# EAGLE design ac_monitor (EAGLE 9.5.2)
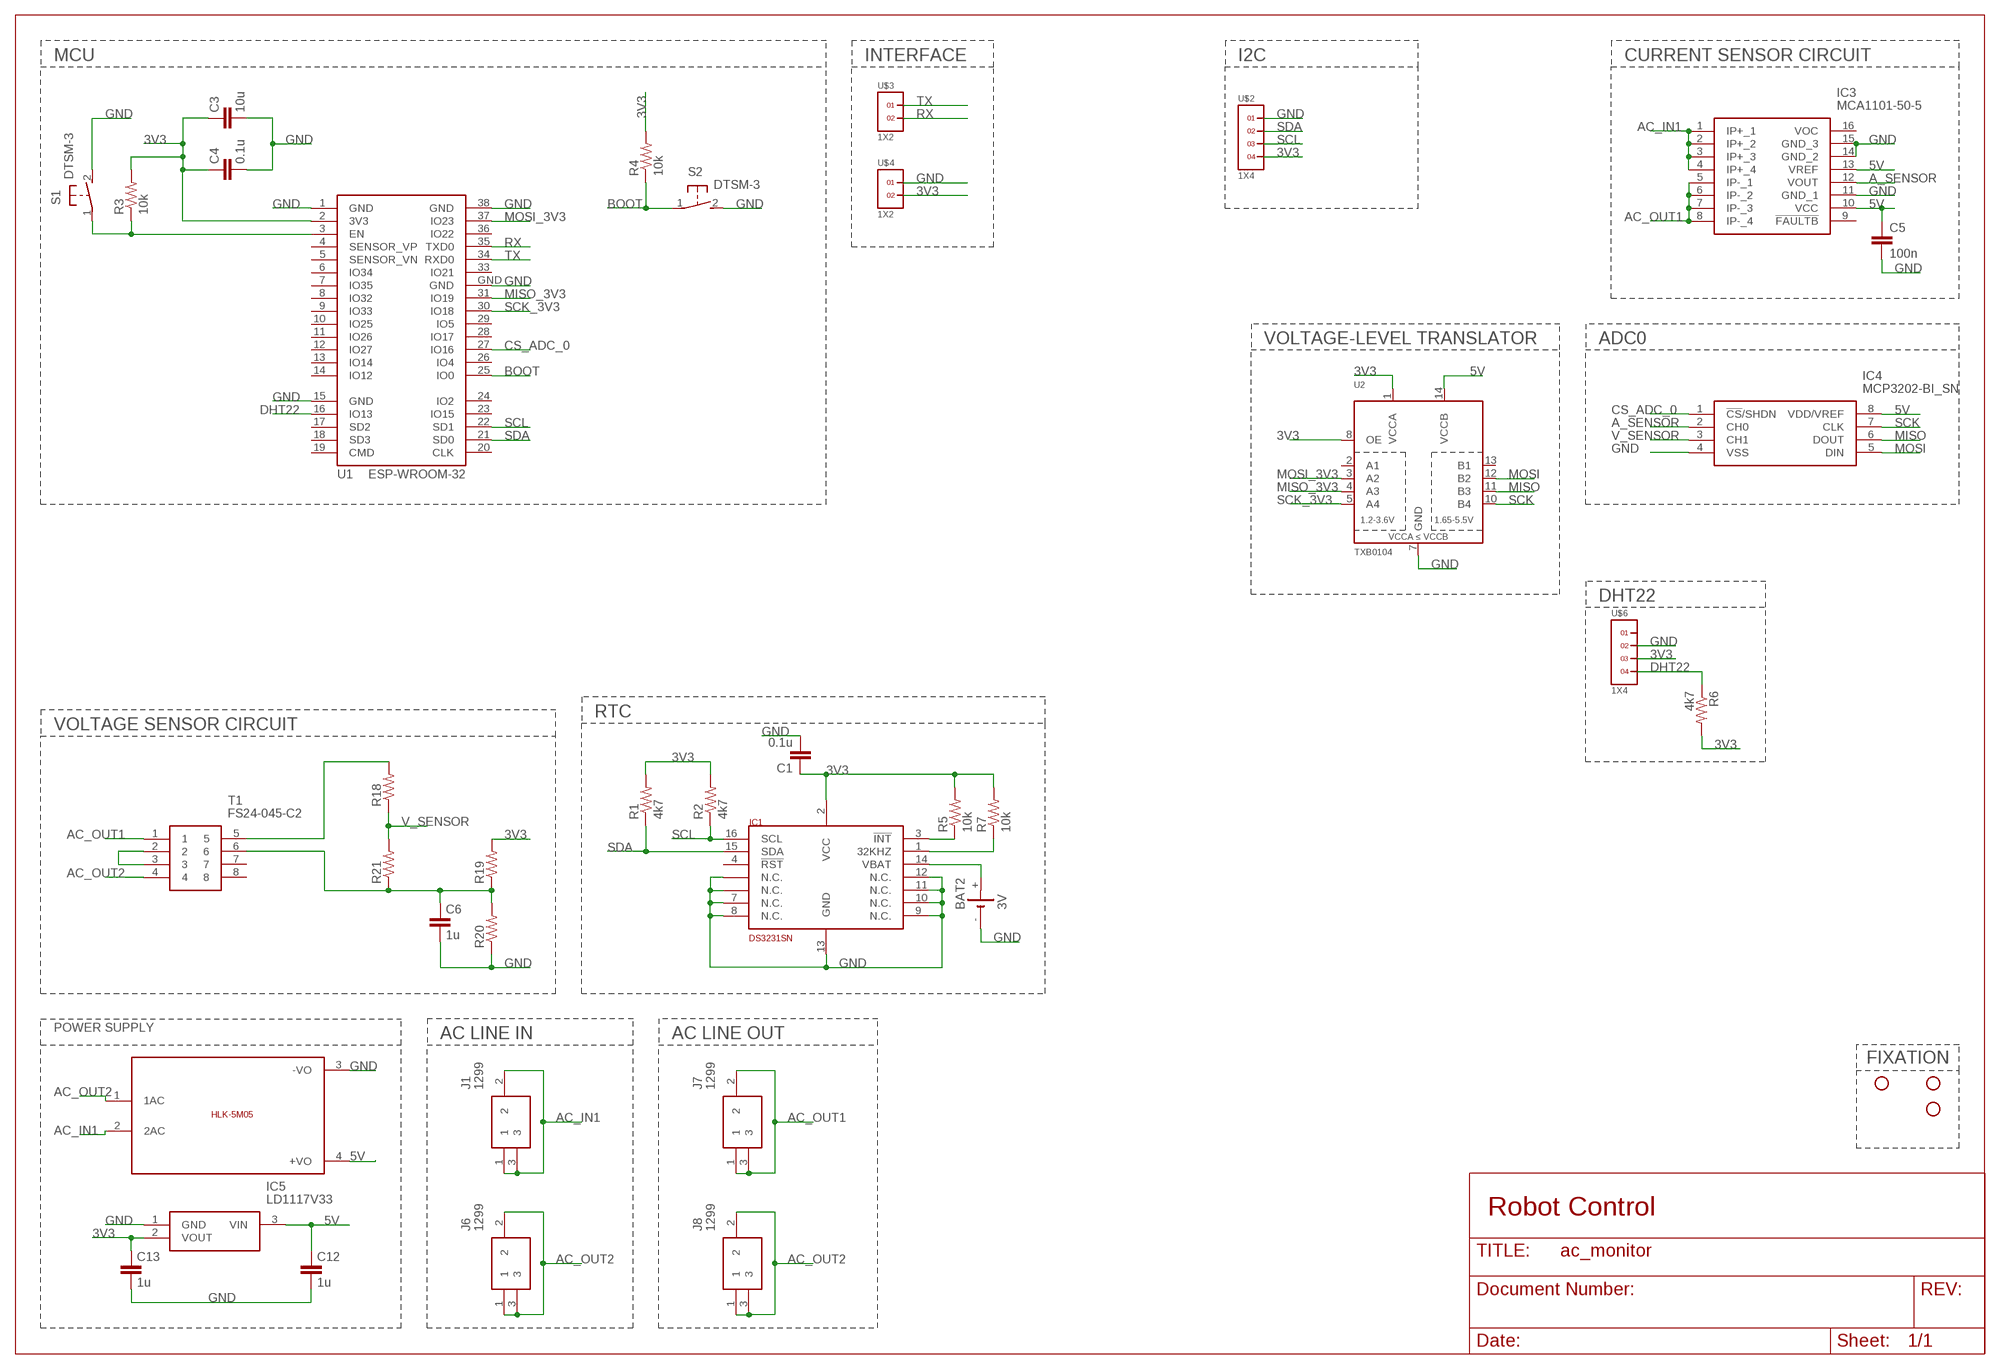
[diagram p0: schematic, sheet 1]

## Parts
BAT2  3V  CH291-1220LF  [CH291-1220LF]
C1  0.1u  C-EUC0805K  [C0805K]
C3  10u  C-EUC0805  [C0805]
C4  0.1u  C-EUC0805  [C0805]
C5  100n  C-EUC0805K  [C0805K]
C6  1u  C-EUC0805  [C0805]
C12  1u  C-EU025-025X050  [C025-025X050]
C13  1u  C-EU025-025X050  [C025-025X050]
IC1  DS3231SN  [SO16W]
IC3  MCA1101-50-5  [SOIC127P1031X264-16N]
IC4  MCP3202-BI_SN  [SOIC127P600X175-8N]
IC5  LD1117V33  [TO270P460X1020X2008-3P]
J1  1299  [1299]
J6  1299  [1299]
J7  1299  [1299]
J8  1299  [1299]
R1  4k7  R-US_R0805  [R0805]
R2  4k7  R-US_R0805  [R0805]
R3  10k  R-US_R0805  [R0805]
R4  10k  R-US_R0805  [R0805]
R5  10k  R-US_R0805  [R0805]
R6  4k7  R-US_R0805  [R0805]
R7  10k  R-US_R0805  [R0805]
R18  270k  R-US_R0805  [R0805]
R19  120k  R-US_R0805  [R0805]
R20  470k  R-US_R0805  [R0805]
R21  33k  R-US_R0805  [R0805]
S1  DTSM-3  [DTSM-3]
S2  DTSM-3  [DTSM-3]
STANDOFF2  STAND-OFF  [STAND-OFF]
STANDOFF3  STAND-OFF  [STAND-OFF]
STANDOFF4  STAND-OFF  [STAND-OFF]
T1  FS24-045-C2  [FS24045C2]
U1  ESP-WROOM-32  [ESP-WROOM-32]
U2  TXB0104  TXB0104PWR  [TSSOP14]
U$2  1X4  [1X4]
U$3  1X2  [1X2]
U$4  1X2  [1X2]
U$5  5VDC/5W  HLK-5M05  [HLK-5M05]
U$6  1X4  [1X4]

## Nets
3V3: C1.1 C3.1 C4.1 C13.1 IC1.2(VCC) IC5.2(VOUT) R1.2 R2.2 R3.2 R4.2 R5.2 R6.2 R7.2 R19.2 U1.2(3V3) U2.1(VCCA) U2.8(OE) U$2.4 U$4.2 U$6.3
5V: C5.1 C12.1 IC3.10(VCC) IC3.13(VREF) IC4.8(VDD/VREF) IC5.3(VIN) U2.14(VCCB) U$5.4(+VO)
A_SENSOR: IC3.12(VOUT) IC4.2(CH0)
AC_IN1: IC3.1(IP+_1) IC3.2(IP+_2) IC3.3(IP+_3) IC3.4(IP+_4) J1.1 J1.2 J1.3 U$5.2(2AC)
AC_OUT1: IC3.5(IP-_1) IC3.6(IP-_2) IC3.7(IP-_3) IC3.8(IP-_4) J7.1 J7.2 J7.3 T1.1
AC_OUT2: J6.1 J6.2 J6.3 J8.1 J8.2 J8.3 T1.4 U$5.1(1AC)
BOOT: R4.1 S2.1 U1.25(IO0)
CS_ADC_0: IC4.1(!CS!/SHDN) U1.27(IO16)
DHT22: R6.1 U1.16(IO13) U$6.4
GND: BAT2.- C1.2 C3.2 C4.2 C5.2 C6.2 C12.2 C13.2 IC1.5(N.C.) IC1.6(N.C.) IC1.7(N.C.) IC1.8(N.C.) IC1.9(N.C.) IC1.10(N.C.) IC1.11(N.C.) IC1.12(N.C.) IC1.13(GND) IC3.11(GND_1) IC3.14(GND_2) IC3.15(GND_3) IC4.4(VSS) IC5.1(GND) R20.1 S1.2 S2.2 U1.1(GND) U1.15(GND) U1.38(GND) U1.GND U2.7(GND) U$2.1 U$4.1 U$5.3(-VO) U$6.2
MISO: IC4.6(DOUT) U2.11(B3)
MISO_3V3: U1.31(IO19) U2.4(A3)
MOSI: IC4.5(DIN) U2.12(B2)
MOSI_3V3: U1.37(IO23) U2.3(A2)
N$1: R18.2 T1.5
N$2: IC1.3(!INT) R5.1
N$3: T1.2 T1.3
N$4: IC1.1(32KHZ) R7.1
N$5: R3.1 S1.1 U1.3(EN)
N$12: C6.1 R19.1 R20.2 R21.1 T1.6
N$17: BAT2.+ IC1.14(VBAT)
RX: U1.35(TXD0) U$3.2
SCK: IC4.7(CLK) U2.10(B4)
SCK_3V3: U1.30(IO18) U2.5(A4)
SCL: IC1.16(SCL) R2.1 U1.22(SD1) U$2.3
SDA: IC1.15(SDA) R1.1 U1.21(SD0) U$2.2
TX: U1.34(RXD0) U$3.1
V_SENSOR: IC4.3(CH1) R18.1 R21.2
Unconnected: IC1.4(!RST) IC3.9(!FAULTB) IC3.16(VOC) T1.7 T1.8 U1.4(SENSOR_VP) U1.5(SENSOR_VN) U1.6(IO34) U1.7(IO35) U1.8(IO32) U1.9(IO33) U1.10(IO25) U1.11(IO26) U1.12(IO27) U1.13(IO14) U1.14(IO12) U1.17(SD2) U1.18(SD3) U1.19(CMD) U1.20(CLK) U1.23(IO15) U1.24(IO2) U1.26(IO4) U1.28(IO17) U1.29(IO5) U1.33(IO21) U1.36(IO22) U2.2(A1) U2.13(B1) U$6.1

## Notes on the sheet
- MCU | INTERFACE | I2C | CURRENT SENSOR CIRCUIT
- VOLTAGE-LEVEL TRANSLATOR | ADC0
- DHT22
- RTC
- VOLTAGE SENSOR CIRCUIT
- POWER SUPPLY
- AC LINE IN | AC LINE OUT
- FIXATION
- Robot Control

## Library data of the parts
BAT2 = battery:CH291-1220LF: Battery Holder, SMT, 12mm multicomp PART NO. CH291-1220LF Source: Data sheet <http://www.farnell.com/datasheets/1505860.pdf>
C1 C3-C6 C12 C13 = rcl:C-EU: CAPACITOR, European symbol; SPICEPREFIX: C
IC1 = electronic-labs:DS3231SN
IC3 = MCA1101-50-5:MCA1101-50-5: Board Mount Current Sensors High Accuracy 50A Current Sensor, 5V, Fixed gain, 1.5MHz 3dB BW, OCP, Galvanic Isolation. UL/IEC/EN60950-1 and UL1577 certified. SOIC-16 Source: Datasheet <https://componentsearchengine.com/Datasheets/1/MCA1101-50-5.pdf>; DESCRIPTION: Board Mount Current Sensors High Accuracy 50A Current Sensor, 5V, Fixed gain, 1.5MHz 3dB BW, OCP, Galvanic Isolation. UL/IEC/EN60950-1 and UL1577 certified. SOIC-16; HEIGHT: 2.64mm; MANUFACTURER_NAME: ACEINNA; MANUFACTURER_PART_NUMBER: MCA1101-50-5; MOUSER_PART_NUMBER: 438-MCA1101-50-5; MOUSER_PRICE-STOCK: https://www.mouser.com/Search/Refine.aspx?Keyword=438-MCA1101-50-5
IC4 = SamacSys_Parts:MCP3202-BI_SN: IC, A-D, Converter, 12 bit, SMT, MCP3202BISN Source: Datasheet <https://componentsearchengine.com/Datasheets/1/MCP3202-BI_SN.pdf>; DESCRIPTION: IC, A-D, Converter, 12 bit, SMT, MCP3202BISN; HEIGHT: 1.75mm; MANUFACTURER_NAME: Microchip; MANUFACTURER_PART_NUMBER: MCP3202-BI/SN; MOUSER_PART_NUMBER: 579-MCP3202BISN; MOUSER_PRICE-STOCK: https://www.mouser.com/Search/Refine.aspx?Keyword=579-MCP3202BISN
IC5 = SamacSys_Parts:LD1117V33: 800mA,3.3V,LDO Voltage Reg.,LD1117V33 STMicroelectronics LD1117V33, LDO Voltage Regulator, 1.3A, 3.3 V +/-1%, 3-Pin TO-220 Source: Datasheet <https://componentsearchengine.com/Datasheets/1/LD1117V33.pdf>; DESCRIPTION: 800mA,3.3V,LDO Voltage Reg.,LD1117V33 STMicroelectronics LD1117V33, LDO Voltage Regulator, 1.3A, 3.3 V +/-1%, 3-Pin TO-220; HEIGHT: 4.6mm; MANUFACTURER_NAME: STMicroelectronics; MANUFACTURER_PART_NUMBER: LD1117V33; MOUSER_PART_NUMBER: 511-LD1117V33; MOUSER_PRICE-STOCK: https://www.mouser.com/Search/Refine.aspx?Keyword=511-LD1117V33
J1 J6-J8 = 1299:1299: Terminals 10-32 SCREW UNASSEMBLED Source: Datasheet <https://componentsearchengine.com/Datasheets/1/1299.pdf>; DESCRIPTION: Terminals 10-32 SCREW UNASSEMBLED; HEIGHT: 2.61mm; MANUFACTURER_NAME: Keystone Electronics; MANUFACTURER_PART_NUMBER: 1299; MOUSER_PART_NUMBER: 534-1299; MOUSER_PRICE-STOCK: https://www.mouser.com/Search/Refine.aspx?Keyword=534-1299
R1-R7 R18-R21 = rcl:R-US_: RESISTOR, American symbol; SPICEPREFIX: R
S1 S2 = switch-tact:DTSM-3
STANDOFF2-STANDOFF4 = SparkFun-Hardware:STAND-OFF: Stand Off Drill holes for mechanically mounting via screws, standoffs, etc. Note: Use the keepout ring to avoid running the screw head into surrounding components. Variant Overviews STAND-OFF - Mechanical footprint for a #4 phillips button head screw. STAND-OFF-TIGHT - Mechanical footprint for a #4 phillips button head screw, Example SparkFun Products Screw - Phillips Head (1/4", 4-40, 10 pack) <https://www.sparkfun.com/products/10453> (PRT-10453) Screw - Phillips Head (1/2", 4-40, 10 pack) <https://www.sparkfun.com/products/10452> (PRT-10452) Screw - Phillips Head (3/4", 4-40, 10 pack) <https://www.sparkfun.com/products/10451> (PRT-10451) Screw - Phillips Head (1", 4-40, 10 pack) <https://www.sparkfun.com/products/10450> (PRT-10450)
T1 = SamacSys_Parts:FS24-045-C2: Power Transformers Power Transformer, PC Mount, Class 2/3, 8Pin, 1.1 V A, 12/24VDC (Nominal Secondary) Output, Primary Input, 24VDC CT at 0.045A Secondary in Series, 12VDC at 0.09A Secondary in Parallel Source: Datasheet <https://componentsearchengine.com/Datasheets/1/FS24-045-C2.pdf>; DESCRIPTION: Power Transformers Power Transformer, PC Mount, Class 2/3, 8Pin, 1.1 V A, 12/24VDC (Nominal Secondary) Output, Primary Input, 24VDC CT at 0.045A Secondary in Series, 12VDC at 0.09A Secondary in Parallel; HEIGHT: 28mm; MANUFACTURER_NAME: Triad Magnetics; MANUFACTURER_PART_NUMBER: FS24-045-C2; MOUSER_PART_NUMBER: 553-FS24-045-C2; MOUSER_PRICE-STOCK: https://www.mouser.com/Search/Refine.aspx?Keyword=553-FS24-045-C2
U1 = esp32:ESP-WROOM-32: Espressif Systems ESP-WROOM-32
U2 = SparkFun-IC-Comms:TXB0104PWR: 4-Bit Bi-Directional Level Shifter 1.2V-3.6V (VCCA) to 1.65V-5.5V (VCCB) bi-directional level shifter with auto direction sensing. Max data rate - VCCA 1.8V: 20Mbps (50ns), VCCA 3.3V: 100Mbps (10ns) Digikey: 296-21929-1-ND (TSSOP) Datasheet <http://cdn.sparkfun.com/datasheets/BreakoutBoards/txb0104.pdf> SparkFun Products SparkFun Cellular Shield - MG2639 <https://www.sparkfun.com/products/13120> (CEL-13120) SparkFun Level Shifting microSD Breakout <https://www.sparkfun.com/products/13743> (DEV-13743) SparkFun Voltage-Level Translator Breakout - TXB0104 <https://www.sparkfun.com/products/11771> (BOB-11771) SparkFun Block for Intel® Edison - UART <https://www.sparkfun.com/products/13040> (DEV-13040) SparkFun Block for Intel® Edison - Arduino <https://www.sparkfun.com/products/13036> (DEV-13036); PROD_ID: IC-13929
U$2 U$6 = headers(2mm):1X4
U$3 U$4 = headers(2mm):1X2
U$5 = HLK-5M05:HLK-5M05: HLK-5M05 is an 5Volt/5W smps developed by HI-LINK; SIZE: 23x38(mm)

## Board
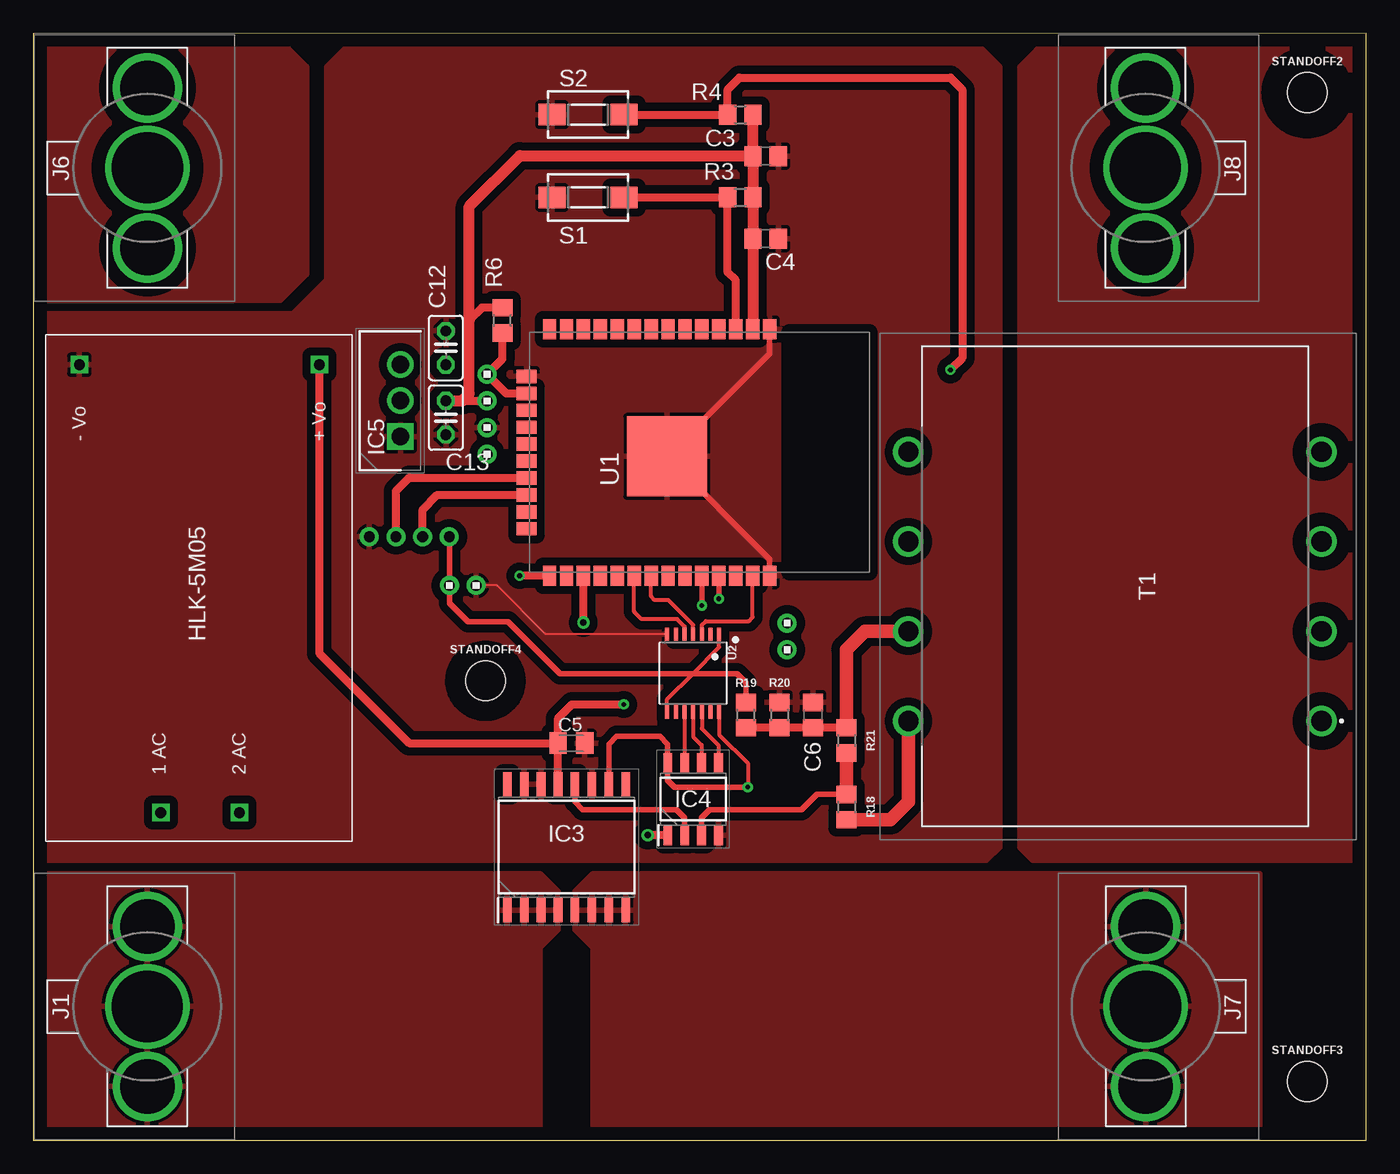
[diagram p1: board, top side]
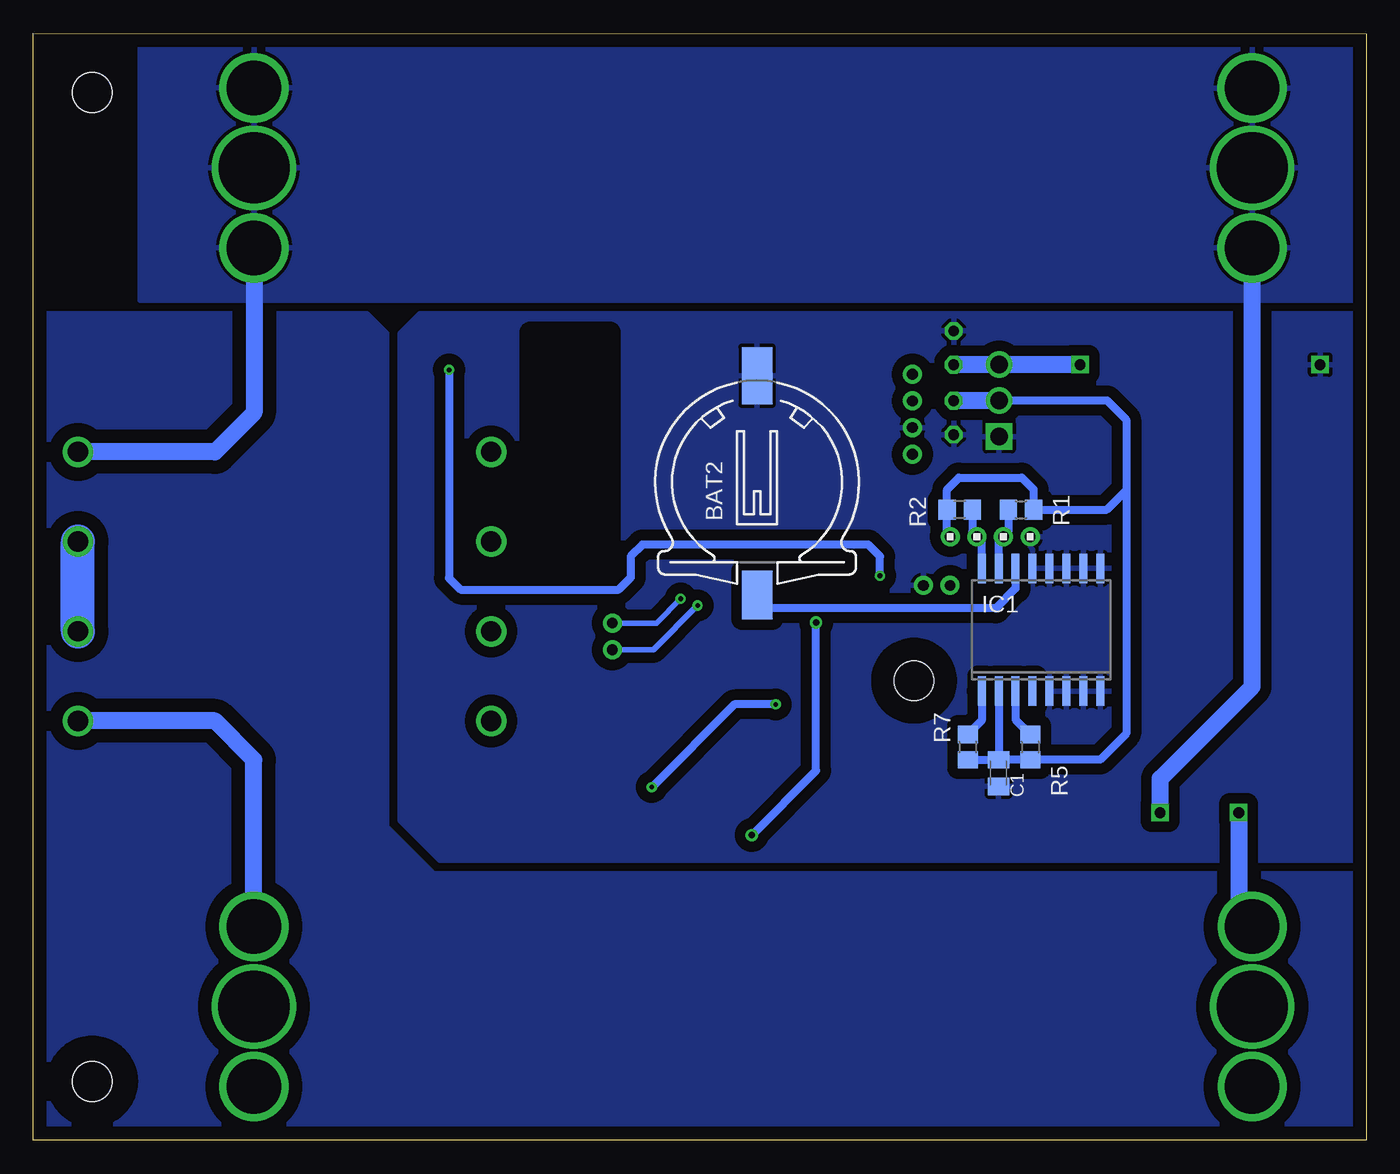
[diagram p2: board, bottom side, seen from below]

Size 100 x 83.03 mm. Coordinates in mm from the lower left corner, seen from the top.
Outline: 0,0 100,0.03 100,83.03 0,83 0,0
Copper layers (1*16): Top 0.035mm / dielectric 1.5mm / Bottom 0.035mm
Design rules "default": minimum track width 6mil, minimum drill 0.35mm, track to track 6mil, track to pad 6mil, pad to pad 6mil, via to via 6mil, smd to smd 6mil, copper to edge 40mil, drill to drill 6mil, minimum pad ring 10mil, minimum via ring 8mil, stop-mask expansion 4mil, vias tented up to drill 0mil, thermal gap 10mil

### Footprints (pad centres in the part's own frame; a part is rotated, then mirrored left to right if it is on the bottom)
CH291-1220LF = smd 2.3 x 3.66: + 0,-2.296 | smd 2.3 x 4.3: - 0,14.146
C0805K = smd 1.3 x 1.6: 1 -1,0; 2 1,0
C0805 = smd 1.3 x 1.5: 1 -0.95,0; 2 0.95,0
C025-025X050 = drill 0.813 octagon: 1 -1.27,0; 2 1.27,0
SO16W = smd 0.6 x 2.2: 1 -4.445,-4.6; 2 -3.175,-4.6; 3 -1.905,-4.6; 4 -0.635,-4.6; 5 0.635,-4.6; 6 1.905,-4.6; 7 3.175,-4.6; 8 4.445,-4.6; 9 4.445,4.6; 10 3.175,4.6; 11 1.905,4.6; 12 0.635,4.6; 13 -0.635,4.6; 14 -1.905,4.6; 15 -3.175,4.6; 16 -4.445,4.6
SOIC127P1031X264-16N = smd 1.8 x 0.65: 1 -4.725,4.445; 2 -4.725,3.175; 3 -4.725,1.905; 4 -4.725,0.635; 5 -4.725,-0.635; 6 -4.725,-1.905; 7 -4.725,-3.175; 8 -4.725,-4.445; 9 4.725,-4.445; 10 4.725,-3.175; 11 4.725,-1.905; 12 4.725,-0.635; 13 4.725,0.635; 14 4.725,1.905; 15 4.725,3.175; 16 4.725,4.445
SOIC127P600X175-8N = smd 1.5 x 0.65: 1 -2.7,1.905; 2 -2.7,0.635; 3 -2.7,-0.635; 4 -2.7,-1.905; 5 2.7,-1.905; 6 2.7,-0.635; 7 2.7,0.635; 8 2.7,1.905
TO270P460X1020X2008-3P = drill 1.32 pad 1.98 square: 1 0,0 | drill 1.32 pad 1.98: 2 2.7,0; 3 5.4,0
1299 = drill 4.08 pad 5.2: 1 0,0; 2 11.99,0 | drill 5.33 pad 6.3: 3 5.995,0
R0805 = smd 1.3 x 1.5: 1 -0.95,0; 2 0.95,0
DTSM-3 = smd 2 x 1.6: 1 -2.7,0; 2 2.7,0
STAND-OFF = hole 3: 0,0
FS24045C2 = drill 1.524 pad 2.286: 1 -10.096,-15.272; 2 -3.365,-15.272; 3 3.365,-15.272; 4 10.096,-15.272; 5 -10.096,15.729; 6 -3.365,15.729; 7 3.365,15.729; 8 10.096,15.729
ESP-WROOM-32 = smd 1.5 x 1: 1 -9.25,7; 2 -9.25,5.73; 3 -9.25,4.46; 4 -9.25,3.19; 5 -9.25,1.92; 6 -9.25,0.65; 7 -9.25,-0.62; 8 -9.25,-1.89; 9 -9.25,-3.16; 10 -9.25,-4.43; 11 -9.25,-5.7; 12 -9.25,-6.97; 13 -9.25,-8.24; 14 -9.25,-9.51; 25 9.25,-9.51; 26 9.25,-8.24; 27 9.25,-6.97; 28 9.25,-5.7; 29 9.25,-4.43; 30 9.25,-3.16; 31 9.25,-1.89; 32 9.25,-0.62; 33 9.25,0.65; 34 9.25,1.92; 35 9.25,3.19; 36 9.25,4.46; 37 9.25,5.73; 38 9.25,7 | smd 1 x 1.5: 15 -5.7,-11.25; 16 -4.43,-11.25; 17 -3.16,-11.25; 18 -1.89,-11.25; 19 -0.62,-11.25; 20 0.65,-11.25; 21 1.92,-11.25; 22 3.19,-11.25; 23 4.46,-11.25; 24 5.73,-11.25 | smd 6 x 6: GND 0.3,-0.7
TSSOP14 = smd 0.305 x 0.991: 1 -1.95,-2.918; 2 -1.3,-2.918; 3 -0.65,-2.918; 4 0,-2.918; 5 0.65,-2.918; 6 1.3,-2.918; 7 1.95,-2.918; 8 1.95,2.918; 9 1.3,2.918; 10 0.65,2.918; 11 0,2.918; 12 -0.65,2.918; 13 -1.3,2.918; 14 -1.95,2.918
1X4 = drill 0.8 pad 1.422: 1 -3,0; 2 -1,0; 3 1,0; 4 3,0
1X2 = drill 0.8 pad 1.422: 1 -1,0; 2 1,0
HLK-5M05 = drill 0.8 square: 1 -16.85,-2.93; 2 -16.85,2.97; 3 16.75,9.07; 4 16.75,-8.93

### Placement (x,y rotation side)
BAT2  45.7,43.2 0 bottom
C1  27.58,27.55 270 bottom
C3  54.94,73.83 0 top
C4  54.94,67.63 0 top
C5  40.37,29.8 0 top
C6  58.49,31.9 90 top
C12  30.95,59.44 90 top
C13  30.95,54.2 270 top
IC1  24.4,38.3 0 bottom
IC3  40,22 90 top
IC4  49.5,25.6 90 top
IC5  27.54,52.78 90 top
J1  8.55,4.05 90 top
J6  8.56,66.94 90 top
J7  83.45,16.04 270 top
J8  83.44,78.93 270 top
R1  25.9,47.31 0 bottom
R2  30.5,47.31 180 bottom
R3  53.04,70.72 0 top
R4  53.04,76.93 0 top
R5  25.2,29.5 270 bottom
R6  35.19,61.5 90 top
R7  29.9,29.5 270 bottom
R18  61.01,25 270 top
R19  53.46,31.9 90 top
R20  55.98,31.9 270 top
R21  61.01,30 270 top
S1  41.62,70.72 180 top
S2  41.62,76.93 180 top
STANDOFF2  95.58,78.59 0 top
STANDOFF3  95.58,4.43 0 top
STANDOFF4  33.93,34.48 0 top
T1  81.38,41.55 90 top
U1  48.24,51.6 270 top
U2  49.51,35.05 180 top
U$2  28.21,45.28 180 bottom
U$3  56.56,37.8 90 top
U$4  32.22,41.62 180 top
U$5  12.53,41.43 90 top
U$6  34.04,54.46 90 top

### Tracks (layer width: path | path; a pad name or v marks a point on that pad's centre or on a via)
3V3
  Top 0.305: U2.8 47.56,33.09 49.48,35.02 51.46,36.99 U2.1
  Top 0.406: R19.2 53.46,34.34 52.78,35.02 49.48,35.02 39.51,35.02 35.62,38.9 32.62,38.9 31.22,40.3 U$4.2 U$2.4
  Top 0.61: C13.1 U$6.3 | R6.2 33.65,62.45 32.7,61.5
  Top 0.813: C13.1 32.17,55.47 32.7,56 32.7,61.5 32.7,70.05 36.5,73.85 53.97,73.85 C3.1 | C3.1 R3.2 C4.1 53.99,60.87 U1.2 | C3.1 R4.2
  Bottom 0.61: U$2.4 31.45,45.52 R2.2 31.45,48.81 30.56,49.7 25.85,49.7 24.95,48.8 R1.2 19.46,47.31 18,48.77 | 18,48.77 18,54.05 19.43,55.48 IC5.2 | 18,48.77 18,30.5 19.95,28.55 R5.2 C1.1 | R7.2 C1.1 | IC1.2 C1.1
  Bottom 1.27: IC5.2 C13.1
5V  (via drill 0.35)
  Top 0.305: U2.14 51.46,30.44 53.6,28.3 v53.6,26.5
  Top 0.406: v53.6,26.5 48.1,26.5 47.59,27 IC4.8 47.59,29.7 47,30.3 43.77,30.3 43.17,29.7 IC3.10
  Top 0.61: U$5.4 21.46,36.54 28.2,29.8 C5.1 | IC3.13 C5.1 | C5.1 39.37,31.67 40.4,32.7 v44.3,32.7
  Bottom 0.61: v44.3,32.7 47.4,32.7 v53.6,26.5
  Bottom 1.27: U$5.4 IC5.3 C12.1
A_SENSOR
  Top 0.406: IC4.2 48.87,24.2 48.27,24.8 41.22,24.8 40.63,25.39 IC3.12
AC_BOT
  pour Bottom (isolate 1.016): 0,20 70,20 73.5,23.5 73.5,60.5 75,62 100,62 100,0 0,0
AC_IN1
  Bottom 1.27: U$5.2 9.56,17.05 J1.2
  pour Top (isolate 0.813): 0,0 0,20 38,20 39.5,18.5 39.5,16 38,14.5 38,0
AC_OUT1
  Bottom 1.27: J7.1 83.45,28.54 86.37,31.46 T1.1
  pour Top (isolate 0.813): 92,0 92,20 42,20 40.5,18.5 40.5,16 42,14.5 42,0
AC_OUT2
  Bottom 1.27: J8.2 83.44,54.58 86.37,51.65 T1.4 | U$5.1 15.46,27.14 8.56,34.04 J6.1
  pour Bottom (isolate 0.813): 0,83 92,83 92,63 0,63
AC_TOP1
  pour Top (isolate 1.016): 74,22 75,21 100,21 100,83 76.5,83 74,80.5
AC_TOP2
  pour Top (isolate 1.016): 0,83 0,63 18.5,63 20.5,65 20.5,80.5 18,83
BOOT  (via drill 0.35)
  Top 0.61: S2.1 R4.1 52.09,78.81 52.98,79.7 68.81,79.7 69.7,78.81 69.7,58.68 v68.81,57.79 | U1.25 v36.48,42.35
  Bottom 0.61: v36.48,42.35 36.48,43.81 37.36,44.69 54.3,44.69 55.19,43.8 55.19,42.2 56.08,41.31 67.94,41.31 68.81,42.18 v68.81,57.79
CS_ADC_0  (via drill 0.5)
  Top 0.61: IC4.1 v46.1,22.9 | v41.27,38.84 U1.27
  Bottom 0.61: v46.1,22.9 41.27,27.73 v41.27,38.84
DHT22
  Top 0.61: U1.16 35.47,56.03 U$6.4 35.19,58.61 R6.1
GND
  Top 0.152: U2.7 38.43,37.97 34.78,41.62 U$4.1
  Top 0.406: U1.38 55.24,43.6 U1.GND 55.24,59 U1.1
  pour Bottom (isolate 0.813): 0,62 71,62 72.5,60.5 72.5,24 69.5,21 0,21
  pour Top (isolate 0.61): 0,21 71.5,21 72.5,22 72.5,80.5 70,83 24.5,83 22,80.5 22,64.5 19.5,62 0,62
MISO
  Top 0.305: U2.11 49.51,30.28 50.14,29.65 IC4.6
MISO_3V3
  Top 0.305: U2.4 49.51,38.67 47.65,40.53 46.62,40.53 46.35,40.8 U1.31
MOSI
  Top 0.305: U2.12 50.16,30.89 51.41,29.64 IC4.5
MOSI_3V3
  Top 0.305: U2.3 50.16,38.66 50.45,38.95 53.68,38.95 53.97,39.24 U1.37
N$1
  Top 1.016: T1.5 65.65,25.39 64.31,24.05 R18.2
N$2
  Bottom 0.61: IC1.3 26.3,31.55 R5.1
N$3
  Bottom 2.54: T1.2 T1.3
N$4
  Bottom 0.61: IC1.1 28.84,31.5 R7.1
N$5
  Top 0.61: U1.3 52.7,64.5 52.09,65.11 R3.1 S1.1
N$12
  Top 0.61: R21.1 C6.1 R20.2 R19.1
  Top 1.016: T1.6 62.38,38.19 61,36.8 R21.1
N$17
  Bottom 0.61: IC1.14 26.3,41.4 27.8,39.9 44.7,39.9 BAT2.+
RX  (via drill 0.35)
  Top 0.406: U1.35 v51.43,40.62
  Bottom 0.406: v51.43,40.62 53.25,38.8 U$3.2
SCK
  Top 0.305: U2.10 IC4.7
SCK_3V3
  Top 0.305: U2.5 48.86,38.54 48.3,39.1 45.64,39.1 45.08,39.66 U1.30
SCL
  Top 0.61: U$2.3 29.21,47.31 30.31,48.41 U1.22
  Bottom 0.61: IC1.16 28.84,44.91 U$2.3 29.55,45.62 R2.1
SDA
  Top 0.61: U$2.2 27.21,48.71 28.2,49.7 36.97,49.7 U1.21
  Bottom 0.61: IC1.15 27.57,44.91 U$2.2 26.85,45.64 R1.1
TX  (via drill 0.35)
  Top 0.406: U1.34 v50.16,40.12
  Bottom 0.406: v50.16,40.12 53.48,36.8 U$3.1
V_SENSOR
  Top 0.406: IC4.3 50.13,24.2 50.72,24.79 57.63,24.79 58.79,25.95 R18.1
  Top 1.016: R18.1 R21.2